# Altium schematic sheet top_new.SchDoc
size A; Organization: Cal Poly Racing; engineer1: who?
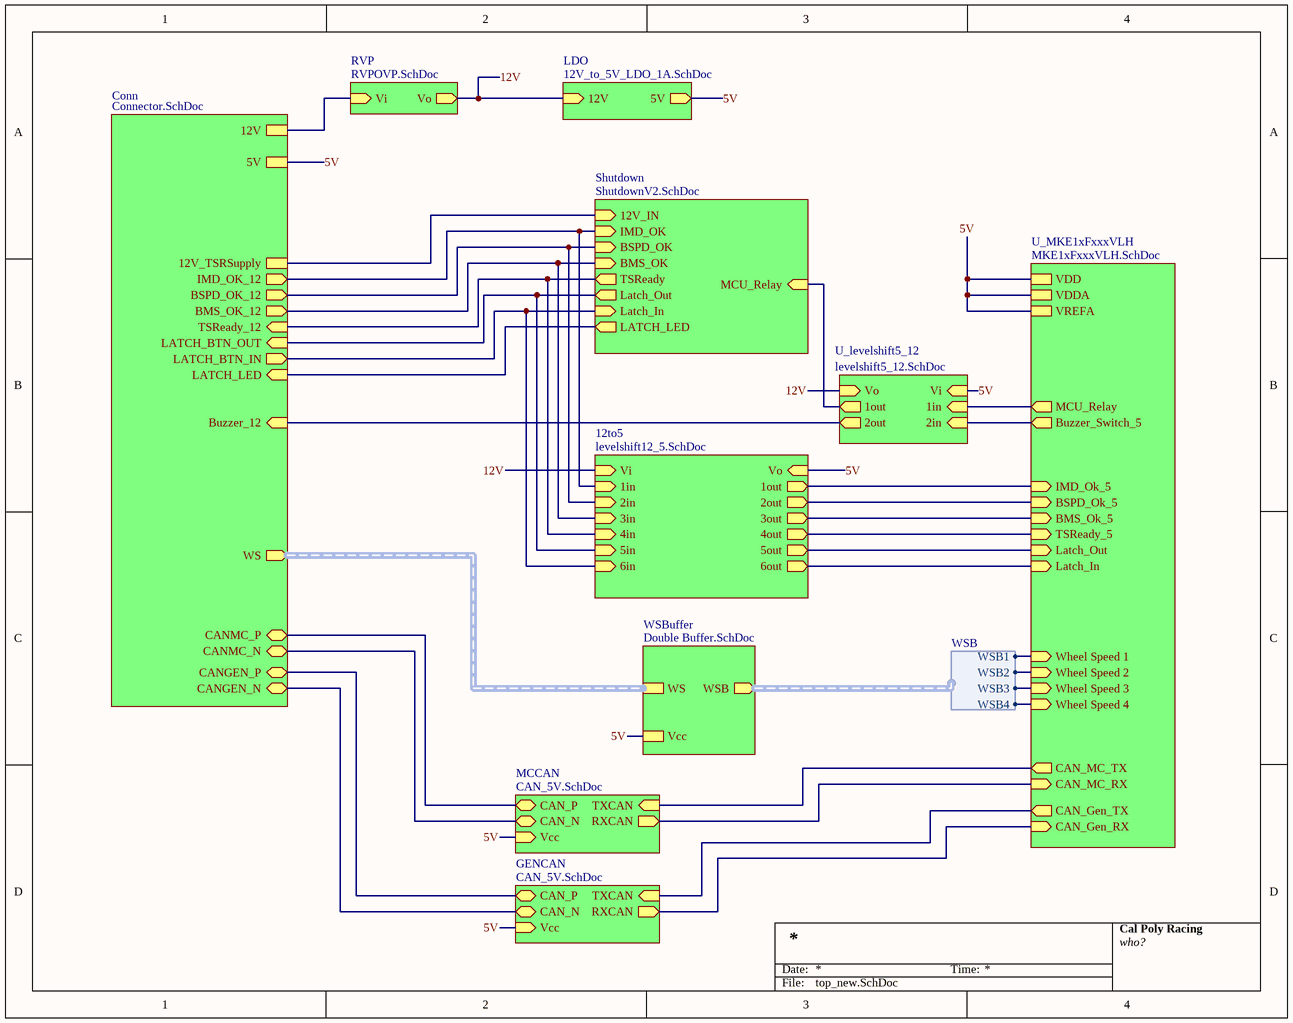
[diagram p0: top_new.SchDoc]

## Sub-sheets
12to5 = levelshift12_5.SchDoc: Vi (in), 1in (in), 2in (in), 3in (in), 4in (in), 5in (in), 6in (in), 1out (out), 2out (out), 3out (out), 4out (out), 5out (out), 6out (out), Vo (in)
Conn = Connector.SchDoc: IMD_OK_12 (out), CANMC_P (bidir), TSReady_12 (in), CANGEN_N (bidir), LATCH_BTN_IN (out), 12V_TSRSupply, LATCH_BTN_OUT (in), BMS_OK_12 (out), CANMC_N (bidir), BSPD_OK_12 (out), CANGEN_P (bidir), Buzzer_12 (in), LATCH_LED (in), 12V, 5V, WS (out, harness WS)
GENCAN = CAN_5V.SchDoc: TXCAN (in), RXCAN (out), CAN_N (bidir), CAN_P (bidir), Vcc (in)
LDO = 12V_to_5V_LDO_1A.SchDoc: 12V (in), 5V (out)
MCCAN = CAN_5V.SchDoc: TXCAN (in), RXCAN (out), CAN_N (bidir), CAN_P (bidir), Vcc (in)
RVP = RVPOVP.SchDoc: Vo (out), Vi (in)
Shutdown = ShutdownV2.SchDoc: BMS_OK (in), IMD_OK (in), MCU_Relay (in), LATCH_LED (out), TSReady (out), Latch_Out (out), Latch_In (in), BSPD_OK (in), 12V_IN (in)
U_levelshift5_12 = levelshift5_12.SchDoc: Vi (in), 1in (in), 2in (in), 1out (out), 2out (out), Vo (in)
U_MKE1xFxxxVLH = MKE1xFxxxVLH.SchDoc: VDD, VDDA, VREFA, BSPD_Ok_5 (in), BMS_Ok_5 (in), IMD_Ok_5 (in), Latch_In (in), TSReady_5 (in), Latch_Out (in), MCU_Relay (out), Buzzer_Switch_5 (out), CAN_MC_RX (in), Wheel Speed 2 (in), Wheel Speed 3 (in), Wheel Speed 4 (in), CAN_MC_TX (out), Wheel Speed 1 (in), CAN_Gen_TX (out), CAN_Gen_RX (in)
WSBuffer = Double Buffer.SchDoc: Vcc, WS, WSB (out, harness WSB)

## Harnesses
WSB: WSB1, WSB2, WSB3, WSB4

## Nets
5V: sheet Conn/5V, sheet WSBuffer/Vcc, sheet LDO/5V, sheet 12to5/Vo, sheet U_levelshift5_12/Vi, sheet U_MKE1xFxxxVLH/VDD, sheet U_MKE1xFxxxVLH/VDDA, sheet U_MKE1xFxxxVLH/VREFA, sheet MCCAN/Vcc, sheet GENCAN/Vcc
12V: sheet RVP/Vo, sheet LDO/12V, sheet 12to5/Vi, sheet U_levelshift5_12/Vo
(unnamed): sheet Conn/IMD_OK_12, sheet Shutdown/IMD_OK, sheet 12to5/1in
(unnamed): sheet Conn/CANMC_P, sheet MCCAN/CAN_P
(unnamed): sheet Conn/TSReady_12, sheet Shutdown/TSReady, sheet 12to5/4in
(unnamed): sheet Conn/CANGEN_N, sheet GENCAN/CAN_N
(unnamed): sheet Conn/LATCH_BTN_IN, sheet Shutdown/Latch_In, sheet 12to5/6in
(unnamed): sheet Conn/12V_TSRSupply, sheet Shutdown/12V_IN
(unnamed): sheet Conn/LATCH_BTN_OUT, sheet Shutdown/Latch_Out, sheet 12to5/5in
(unnamed): sheet Conn/BMS_OK_12, sheet Shutdown/BMS_OK, sheet 12to5/3in
(unnamed): sheet Conn/CANMC_N, sheet MCCAN/CAN_N
(unnamed): sheet Conn/BSPD_OK_12, sheet Shutdown/BSPD_OK, sheet 12to5/2in
(unnamed): sheet Conn/CANGEN_P, sheet GENCAN/CAN_P
(unnamed): sheet Conn/Buzzer_12, sheet U_levelshift5_12/2out
(unnamed): sheet Conn/LATCH_LED, sheet Shutdown/LATCH_LED
(unnamed): sheet Conn/12V, sheet RVP/Vi
(unnamed): sheet Shutdown/MCU_Relay, sheet U_levelshift5_12/1out
(unnamed): sheet 12to5/1out, sheet U_MKE1xFxxxVLH/IMD_Ok_5
(unnamed): sheet 12to5/2out, sheet U_MKE1xFxxxVLH/BSPD_Ok_5
(unnamed): sheet 12to5/3out, sheet U_MKE1xFxxxVLH/BMS_Ok_5
(unnamed): sheet 12to5/4out, sheet U_MKE1xFxxxVLH/TSReady_5
(unnamed): sheet 12to5/5out, sheet U_MKE1xFxxxVLH/Latch_Out
(unnamed): sheet 12to5/6out, sheet U_MKE1xFxxxVLH/Latch_In
(unnamed): sheet U_levelshift5_12/1in, sheet U_MKE1xFxxxVLH/MCU_Relay
(unnamed): sheet U_levelshift5_12/2in, sheet U_MKE1xFxxxVLH/Buzzer_Switch_5
(unnamed): sheet U_MKE1xFxxxVLH/CAN_MC_RX, sheet MCCAN/RXCAN
(unnamed): sheet U_MKE1xFxxxVLH/Wheel Speed 2, sheet WSBuffer/WSB.WSB2
(unnamed): sheet U_MKE1xFxxxVLH/Wheel Speed 3, sheet WSBuffer/WSB.WSB3
(unnamed): sheet U_MKE1xFxxxVLH/Wheel Speed 4, sheet WSBuffer/WSB.WSB4
(unnamed): sheet U_MKE1xFxxxVLH/CAN_MC_TX, sheet MCCAN/TXCAN
(unnamed): sheet U_MKE1xFxxxVLH/Wheel Speed 1, sheet WSBuffer/WSB.WSB1
(unnamed): sheet U_MKE1xFxxxVLH/CAN_Gen_TX, sheet GENCAN/TXCAN
(unnamed): sheet U_MKE1xFxxxVLH/CAN_Gen_RX, sheet GENCAN/RXCAN

## Buses and harness runs
harness sheet Conn/WS = sheet WSBuffer/WS

## Notes on the sheet
- Date:
- Time:
- File: